# EAGLE design charge controller (EAGLE 9.4.0)
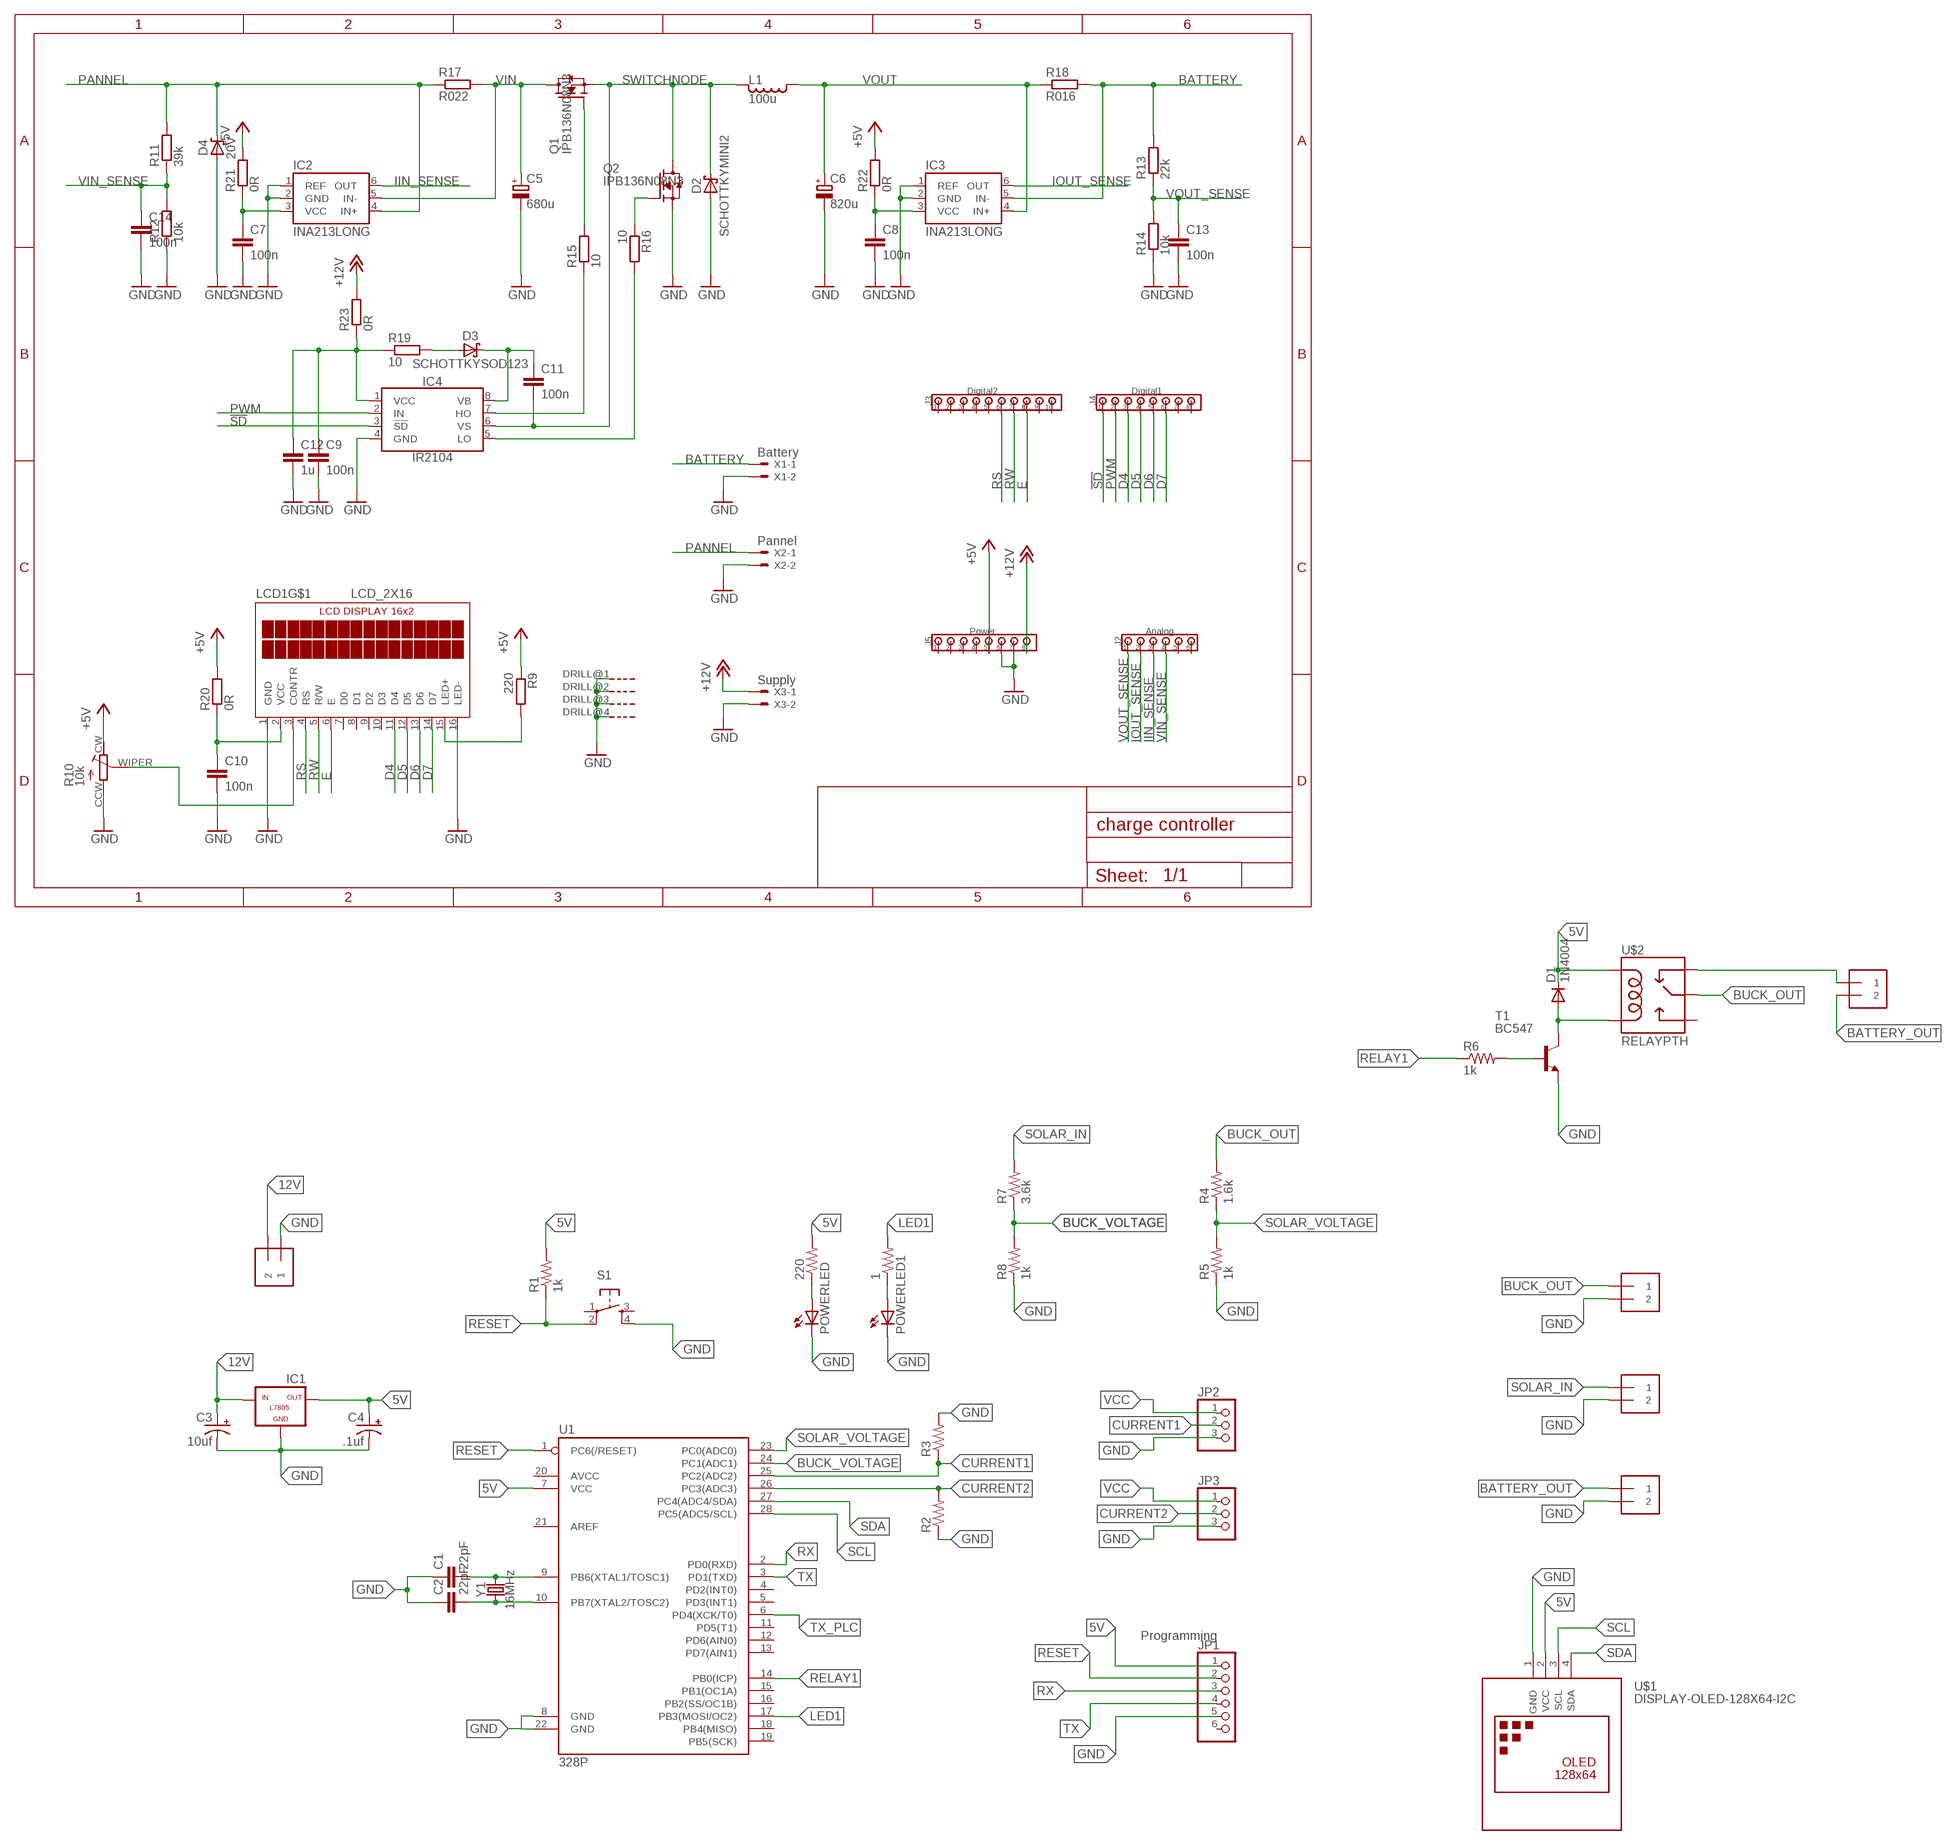
[diagram p0: schematic, sheet 1]

## Parts
1  R-US_0204/5  [0204/5]
220  R-US_0204/5  [0204/5]
BAT_OUT  1X2-3.5MM  [1X2-3.5MM]
BATTERY-OUT  1X2-3.5MM  [1X2-3.5MM]
BUCK-OUT  1X2-3.5MM  [1X2-3.5MM]
C1  22pF  22PF-PTH-2.54MM-200V-5%  [CAP-PTH-2.54]
C2  22pF  22PF-PTH-2.54MM-200V-5%  [CAP-PTH-2.54]
C3  10uf  CPOL-USE5-5  [E5-5]
C4  .1uf  CPOL-USE5-5  [E5-5]
C5  680u  C_POLARIZED10MM  [10MM]
C6  820u  C_POLARIZED10MM  [10MM]
C7  100n  CC0805  [C0805]
C8  100n  CC0805  [C0805]
C9  100n  CC0805  [C0805]
C10  100n  CC0805  [C0805]
C11  100n  CC0805  [C0805]
C12  1u  CC0805  [C0805]
C13  100n  CC0805  [C0805]
C14  100n  CC0805  [C0805]
D1  1N4004  [DO41-10]
D2  SCHOTTKYMINI2  [MINI2-F3-B]
D3  SCHOTTKYSOD123  [SOD123]
D4  20V  ZENERSMC  [SMC]
IC1  L7805  [78XXL]
IC2  INA213LONG  [SC70-6_LONG]
IC3  INA213LONG  [SC70-6_LONG]
IC4  IR2104  [SOIC8]
J1  1X2-3.5MM  [1X2-3.5MM]
J2  Analog  100MIL_6X  [100MIL_6X_ROUND]
J3  Digital2  100MIL_10X  [100MIL_10X_ROUND]
J4  Digital1  100MIL_8X  [100MIL_8X_ROUND]
J5  Power  100MIL_8X  [100MIL_8X_ROUND]
JP1  PINHD-1X6  [1X06]
JP2  PINHD-1X3  [1X03]
JP3  PINHD-1X3  [1X03]
L1  100u  INDUCTORMSS1583  [MSS1583]
LCD1  LCD_2X16  [LCD_2X16]
POWERLED  LED5MM  [LED5MM]
POWERLED1  LED5MM  [LED5MM]
Q1  IPB136N08N3  N-PWR-MOSFETTO263-3  [TO263-3]
Q2  IPB136N08N3  IPB136N08N3_GTO263  [TO263-3@1]
R1  1k  R-US_0204/5  [0204/5]
R2  R-US_0204/5  [0204/5]
R3  R-US_0204/5  [0204/5]
R4  1.6k  R-US_0204/5  [0204/5]
R5  1k  R-US_0204/5  [0204/5]
R6  1k  R-US_0204/5  [0204/5]
R7  3.6k  R-US_0204/5  [0204/5]
R8  1k  R-US_0204/5  [0204/5]
R9  220  RESISTORR0805  [R0805]
R10  10k  TRIMMER3314G  [RTRIM3314G]
R11  39k  RESISTORR0805  [R0805]
R12  10k  RESISTORR0805  [R0805]
R13  22k  RESISTORR0805  [R0805]
R14  10k  RESISTORR0805  [R0805]
R15  10  RESISTORR0805  [R0805]
R16  10  RESISTORR0805  [R0805]
R17  R022  RESISTOR0612  [0612]
R18  R016  RESISTOR0612  [0612]
R19  10  RESISTORR0805  [R0805]
R20  0R  RESISTORR0805  [R0805]
R21  0R  RESISTORR0805  [R0805]
R22  0R  RESISTORR0805  [R0805]
R23  0R  RESISTORR0805  [R0805]
S1  TAC_SWITCHPTH  [TACTILE-PTH]
SOLAR-IN  1X2-3.5MM  [1X2-3.5MM]
T1  BC547  [TO92]
U1  328P  ATMEGA328P_PDIP  [DIP28]
U$1  DISPLAY-OLED-128X64-I2C  [DISPLAY-OLED-128X64-I2C]
U$2  RELAYPTH  [SRD-05VDC-SL-C]
X1  Battery  22-23-2021200MIL  [200MIL_2X]
X2  Pannel  22-23-2021200MIL  [200MIL_2X]
X3  Supply  22-23-2021100MIL  [22-23-2021]
Y1  16MHz  CRYSTAL-16MHZPTH-HC49US  [HC49US]

## Nets
5V: 220.2 C4.+ D1.C IC1.OUT JP1.1 R1.2 U1.7(VCC) U$1.2(VCC) U$2.COIL1
12V: C3.+ IC1.IN J1.2
!SD!: IC4.3(!SD!) J4.1
+5V: J5.5 R9.1 R10.CW R20.2 R21.2 R22.2
+12V: J5.8 R23.2 X3.1
BATTERY: IC3.5(IN-) R13.2 R18.2 X1.1
BATTERY_OUT: BAT_OUT.2 BATTERY-OUT.1
BUCK_OUT: BUCK-OUT.1 R4.2 U$2.SWCOMMON
BUCK_VOLTAGE: R7.1 R8.2 U1.24(PC1(ADC1))
CURRENT1: JP2.2 R3.1 U1.25(PC2(ADC2))
CURRENT2: JP3.2 R2.2 U1.26(PC3(ADC3))
D4: J4.3 LCD1.11(D4)
D5: J4.4 LCD1.12(D5)
D6: J4.5 LCD1.13(D6)
D7: J4.6 LCD1.14(D7)
E: J3.8 LCD1.6(E)
GND: BATTERY-OUT.2 BUCK-OUT.2 C1.1 C2.1 C3.- C4.- C5.- C6.- C7.2 C8.2 C9.2 C10.2 C12.2 C13.2 C14.2 D2.A D4.A IC1.GND IC2.1(REF) IC2.2(GND) IC3.1(REF) IC3.2(GND) IC4.4(GND) J1.1 J5.6 J5.7 JP1.5 JP2.3 JP3.3 LCD1.1(GND) LCD1.16(LED-) LCD1.DRILL@1(G) LCD1.DRILL@2(G) LCD1.DRILL@3(G) LCD1.DRILL@4(G) POWERLED1.K(C) POWERLED.K(C) Q2.3(S) R2.1 R3.2 R5.1 R8.1 R10.CCW R12.1 R14.1 S1.4 SOLAR-IN.2 T1.1(E) U1.8(GND) U1.22(GND) U$1.1(GND) X1.2 X2.2 X3.2
IIN_SENSE: IC2.6(OUT) J2.3
IOUT_SENSE: IC3.6(OUT) J2.2
LED1: 1.2 U1.17(PB3(MOSI/OC2))
N$1: 220.1 POWERLED.A
N$2: C1.2 U1.9(PB6(XTAL1/TOSC1)) Y1.2
N$3: C2.2 U1.10(PB7(XTAL2/TOSC2)) Y1.1
N$4: LCD1.15(LED+) R9.2
N$5: 1.1 POWERLED1.A
N$6: R6.2 T1.2(B)
N$7: D1.A T1.3(C) U$2.COIL0
N$8: Q1.1(G) R15.2
N$9: BAT_OUT.1 U$2.SWCLOSED(SWCLOSE)
N$10: LCD1.3(CONTR) R10.WIPER
N$11: Q2.1(G) R16.1
N$12: D3.A R19.2
N$13: C11.1 D3.C IC4.8(VB)
N$14: IC4.7(HO) R15.1
N$15: IC4.5(LO) R16.2
N$16: C10.1 LCD1.2(VCC) R20.1
N$17: C7.1 IC2.3(VCC) R21.1
N$18: C8.1 IC3.3(VCC) R22.1
N$19: C9.1 C12.1 IC4.1(VCC) R19.1 R23.1
PANNEL: D4.C IC2.4(IN+) R11.2 R17.1 X2.1
PWM: IC4.2(IN) J4.2
RELAY1: R6.1 U1.14(PB0(ICP))
RESET: JP1.2 R1.1 S1.2 U1.1(PC6(/RESET))
RS: J3.6 LCD1.4(RS)
RW: J3.7 LCD1.5(R/W)
RX: JP1.3 U1.2(PD0(RXD))
SCL: U1.28(PC5(ADC5/SCL)) U$1.3(SCL)
SDA: U1.27(PC4(ADC4/SDA)) U$1.4(SDA)
SOLAR_IN: R7.2 SOLAR-IN.1
SOLAR_VOLTAGE: R4.1 R5.2 U1.23(PC0(ADC0))
SWITCHNODE: C11.2 D2.C IC4.6(VS) L1.2 Q1.3(S) Q2.TAB(D)
TX: JP1.4 U1.3(PD1(TXD))
TX_PLC: U1.6(PD4(XCK/T0))
VCC: JP2.1 JP3.1
VIN: C5.+ IC2.5(IN-) Q1.TAB(D) R17.2
VIN_SENSE: C14.1 J2.4 R11.1 R12.2
VOUT: C6.+ IC3.4(IN+) L1.1 R18.1
VOUT_SENSE: C13.1 J2.1 R13.1 R14.2
Unconnected: J2.5 J2.6 J3.1 J3.2 J3.3 J3.4 J3.5 J3.9 J3.10 J4.7 J4.8 J5.1 J5.2 J5.3 J5.4 JP1.6 LCD1.7(D0) LCD1.8(D1) LCD1.9(D2) LCD1.10(D3) S1.1 S1.3 U1.4(PD2(INT0)) U1.5(PD3(INT1)) U1.11(PD5(T1)) U1.12(PD6(AIN0)) U1.13(PD7(AIN1)) U1.15(PB1(OC1A)) U1.16(PB2(SS/OC1B)) U1.18(PB4(MISO)) U1.19(PB5(SCK)) U1.20(AVCC) U1.21(AREF) U$2.SWOPEN

## Notes on the sheet
- Programming

## Library data of the parts
1 220 R1-R8 = adafruit:R-US_: RESISTOR, American symbol
BAT_OUT BATTERY-OUT BUCK-OUT J1 SOLAR-IN = adafruit:1X2: 3.5mm Terminal block http://www.ladyada.net/library/pcb/eaglelibrary.html
C1 C2 = SparkFun-Capacitors:22PF: 22pF ceramic capacitors A capacitor is a passive two-terminal electrical component used to store electrical energy temporarily in an electric field.; PROD_ID: CAP-09128
C3 C4 = adafruit:CPOL-US: POLARIZED CAPACITOR, American symbol
C5 C6 = 00Capacitor:C_POLARIZED
C7-C14 = 00Capacitor:C: Capacitor
D1 = adafruit:1N4004: DIODE General purpose 1N400x type rectifier (With bigger pads) http://www.ladyada.net/library/pcb/eaglelibrary.html
D2 D3 = 00Diode:SCHOTTKY
D4 = 00Diode:ZENER
IC1 = tango:L7805: VOLTAGE REGULATOR
IC2 IC3 = 00Sensor:INA21*: Current-Shunt Monitors Voltage Output, Low- or High-Side Measurement, Bidirectional, Zero-Drift Series; GAIN: 50
IC4 = 00Logic:IR2104: Half-Bridge Driver Up to +600V Gate drive supply 10-20V Deadtime 520ns
J2 = 00Connector:100MIL_6X: 100 mil 6-pin connector
J3 = 00Connector:100MIL_10X: 100mil 10-pin connector
J4 J5 = 00Connector:100MIL_8X: 100 mil 8-pin connector
JP1 = adafruit:PINHD-1X6: PIN HEADER
JP2 JP3 = adafruit:PINHD-1X3: PIN HEADER
L1 = 00Inductor:INDUCTOR
LCD1 = 00Display:LCD_2X16
POWERLED POWERLED1 = adafruit:LED: LED OSRAM: - CHIPLED LG R971, LG N971, LY N971, LG Q971, LY Q971, LO R971, LY R971 LH N974, LH R974 LS Q976, LO Q976, LY Q976 LO Q996 - Hyper CHIPLED LW Q18S LB Q993, LB Q99A, LB R99A - SideLED LS A670, LO A670, LY A670, LG A670, LP A670 LB A673, LV A673, LT A673, LW A673 LH A674 LY A675 LS A676, LA A676, LO A676, LY A676, LW A676 LS A679, LY A679, LG A679 - Hyper Micro SIDELED® LS Y876, LA Y876, LO Y876, LY Y876 LT Y87S - SmartLED LW L88C, LW L88S LB L89C, LB L89S, LG L890 LS L89K, LO L89K, LY L89K LS L896, LA L896, LO L896, LY L896 - TOPLED LS T670, LO T670, LY T670, LG T670, LP T670 LSG T670, LSP T670, LSY T670, LOP T670, LYG T670 LG T671, LOG T671, LSG T671 LB T673, LV T673, LT T673, LW T673 LH T674 LS T676, LA T676, LO T676, LY T676, LB T676, LH T676, LSB T676, LW T676 LB T67C, LV T67C, LT T67C, LS T67K, LO T67K, LY T67K, LW E67C LS E67B, LA E67B, LO E67B, LY E67B, LB E67C, LV E67C, LT E67C LW T67C LS T679, LY T679, LG T679 LS T770, LO T770, LY T770, LG T770, LP T770 LB T773, LV T773, LT T773, LW T773 LH T774 LS E675, LA E675, LY E675, LS T675 LS T776, LA T776, LO T776, LY T776, LB T776 LHGB T686 LT T68C, LB T68C - Hyper Mini TOPLED® LB M676 - Mini TOPLED Santana® LG M470 LS M47K, LO M47K, LY M47K Source: http://www.osram.convergy.de/
Q1 = 00Mosfet:N-PWR-MOSFET
Q2 = 00Mosfet:IPB136N08N3_G
R9 R11-R23 = 00Resistor:RESISTOR: RESISTOR, European symbol
R10 = 00Resistor:TRIMMER
S1 = SparkFun-Retired:TAC_SWITCH: Momentary Switch Button commonly used for reset or general input. Spark Fun Electronics SKU : COM-00097 SMT- SWCH-08247
T1 = transistor:BC547: NPN TRANSISTOR
U1 = SparkFun-IC-Microcontroller:ATMEGA328P_PDIP: Atmel 328P Through hole ATMEGA328P uC used in the Arduino 32kb flash, 1k EEPROM, 2k SRAM Datasheet <http://www.sparkfun.com/datasheets/Components/SMD/ATMega328.pdf> SparkFun Products Storefront component: AVR 28 Pin 20MHz 32K 6A/D - ATMega328P <https://www.sparkfun.com/products/9061> (COM-09061) SparkFun Simon Says - Through-Hole Soldering Kit <https://www.sparkfun.com/products/10547> (KIT-10547) SparkFun Learn to Solder - Simon Says <https://www.sparkfun.com/products/13708> (KIT-13708) SparkFun BigTime Watch Kit <https://www.sparkfun.com/products/11734> (KIT-11734) SparkFun ClockIt <https://www.sparkfun.com/products/10930> (KIT-10930) SparkFun Serial Enabled LCD Kit <https://www.sparkfun.com/products/10097> (LCD-10097) SparkFun Simon Tilts - Through Hole Soldering Kit <https://www.sparkfun.com/products/12634> (KIT-12634) SparkFun Frequency Counter Kit <https://www.sparkfun.com/products/10140> (KIT-10140) FabFM Radio Kit <https://www.sparkfun.com/products/11043> (KIT-11043) SparkFun Binary Blaster Kit <https://www.sparkfun.com/products/12037> (KIT-12037) SparkFun Metro-Gnome <https://www.sparkfun.com/products/9236> (KIT-09236) ATmega328 with Arduino Optiboot (Uno) <https://www.sparkfun.com/products/10524> (DEV-10524); PROD_ID: IC-09136
U$1 = diy-modules:DISPLAY-OLED-128X64-I2C: 128x64 Dot Matrix OLED Module based on SSD1306 chip Variant with I2C interface More details available here: http://www.instructables.com/id/Monochrome-096-i2c-OLED-display-with-arduino-SSD13/ SSD1306 datasheet: https://cdn-shop.adafruit.com/datasheets/SSD1306.pdf Click here to find device on ebay.com <http://www.ebay.com/sch/oled+display+128x64+iic> Note: There are two variants: I2C and SPI. Search for the proper version.
U$2 = SRD-05VDC-SL-C:RELAY: SPDT relay (COM-00101)
X1 X2 = 00Connector:22-23-2021: .100" (2.54mm) Center Header - 2 Pin
X3 = 00Connector:22-23-2021: .100" (2.54mm) Center Header - 2 Pin; MF: MOLEX; MPN: 22-23-2021; OC_FARNELL: 1462926; OC_NEWARK: 25C3832
Y1 = SparkFun-Clocks:CRYSTAL-16MHZ: 16MHz Crystal Digikey Example <http://www.digikey.com/product-search/en?keywords=535-9122-1-ND> Frequency: 16MHz Frequency Stability: ±50ppm Frequency Tolerance: ±20ppm Load Capacitance: 18pF SparkFun Products: Pro Micro -5V/16MHz <https://www.sparkfun.com/products/12640> SparkFun Serial Enabled LCD Kit <https://www.sparkfun.com/products/10097>; PROD_ID: XTAL-08181; SF_ID: COM-00536

## Board
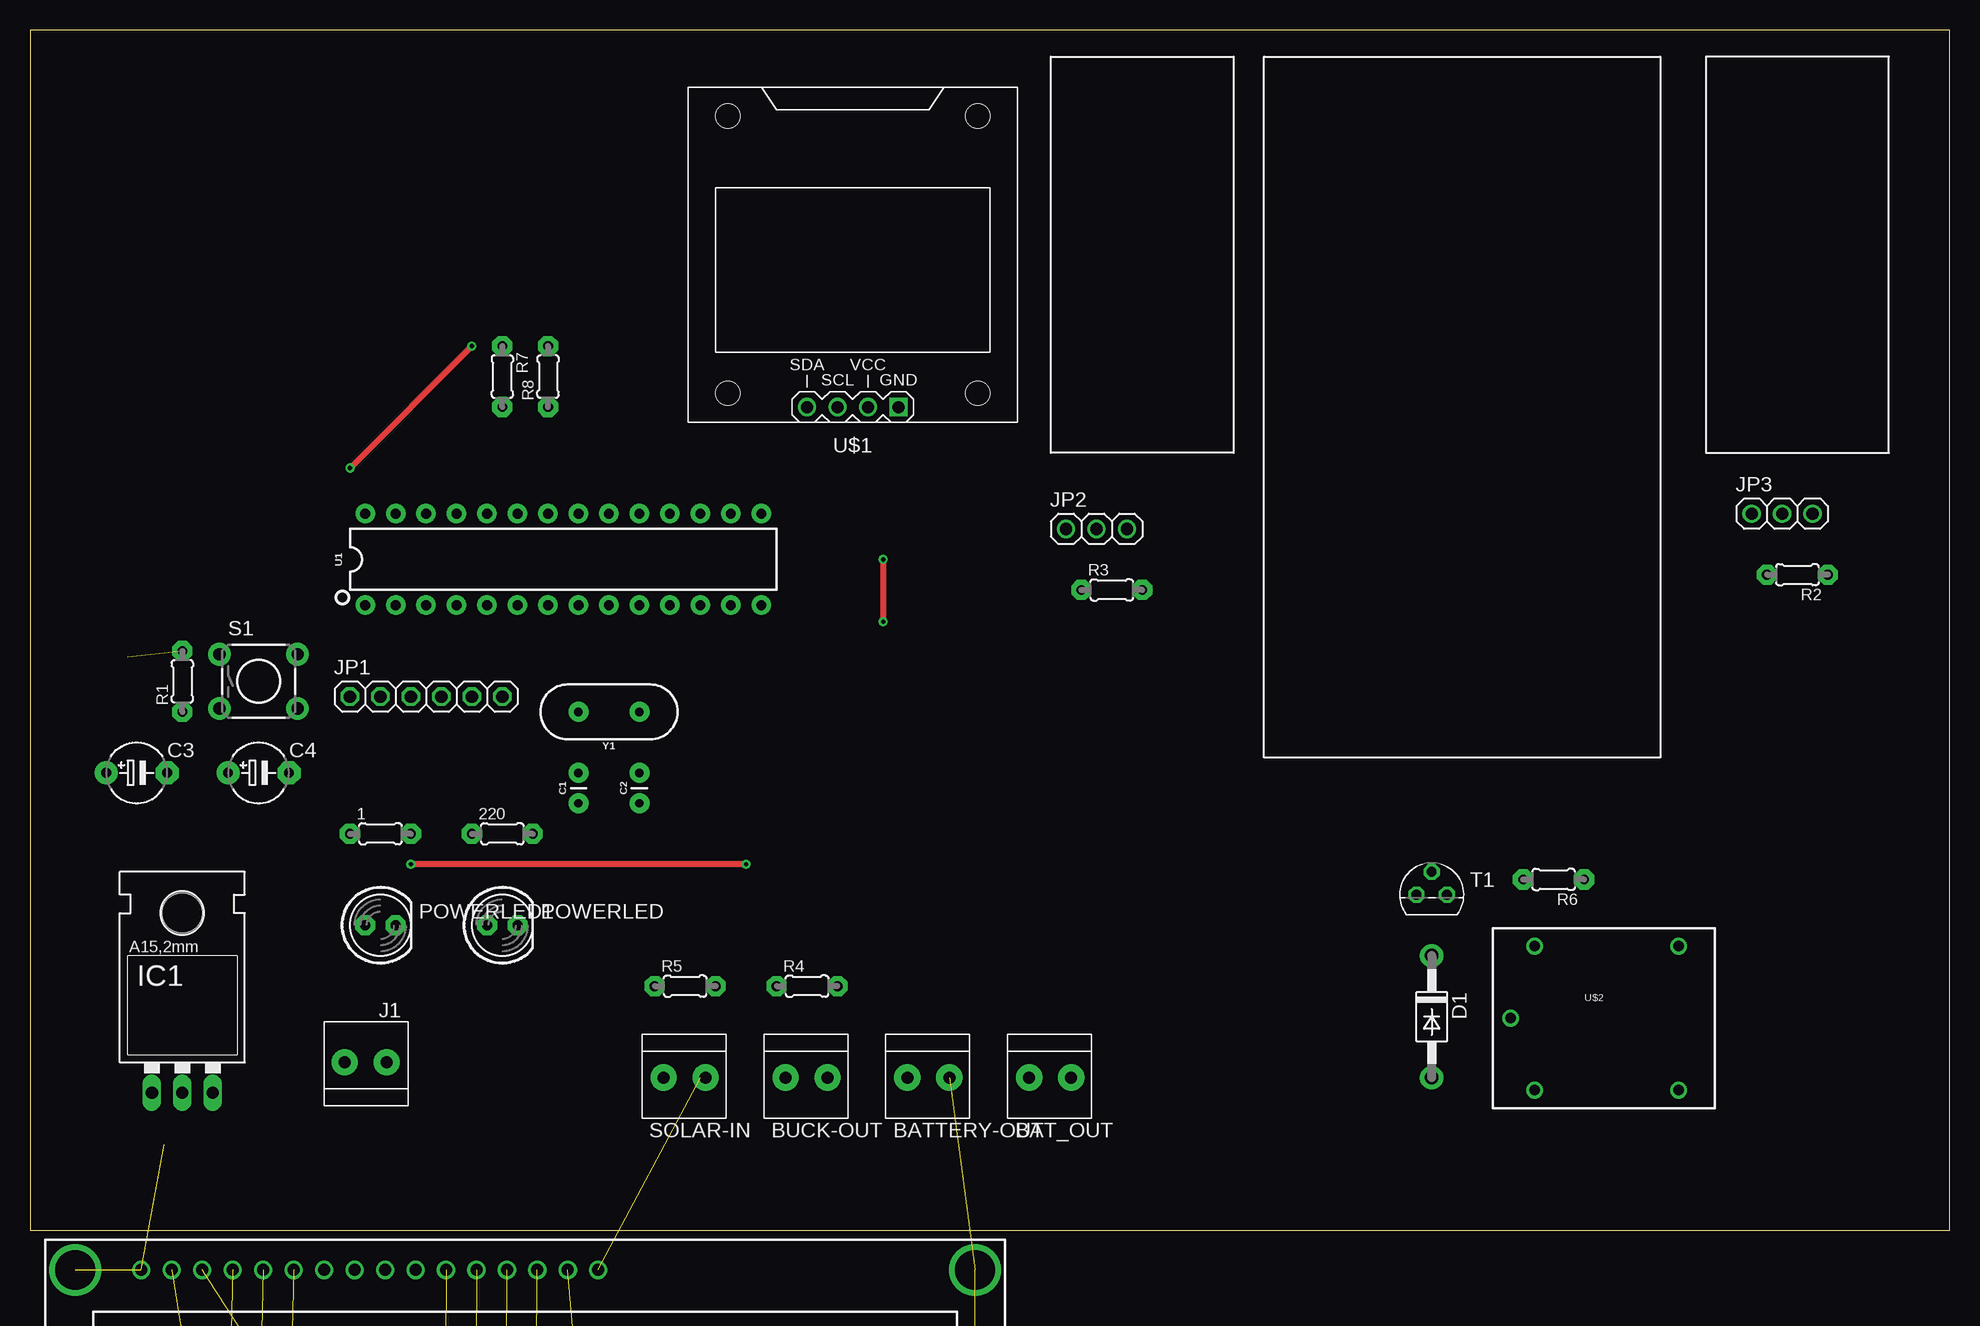
[diagram p1: board, top side]
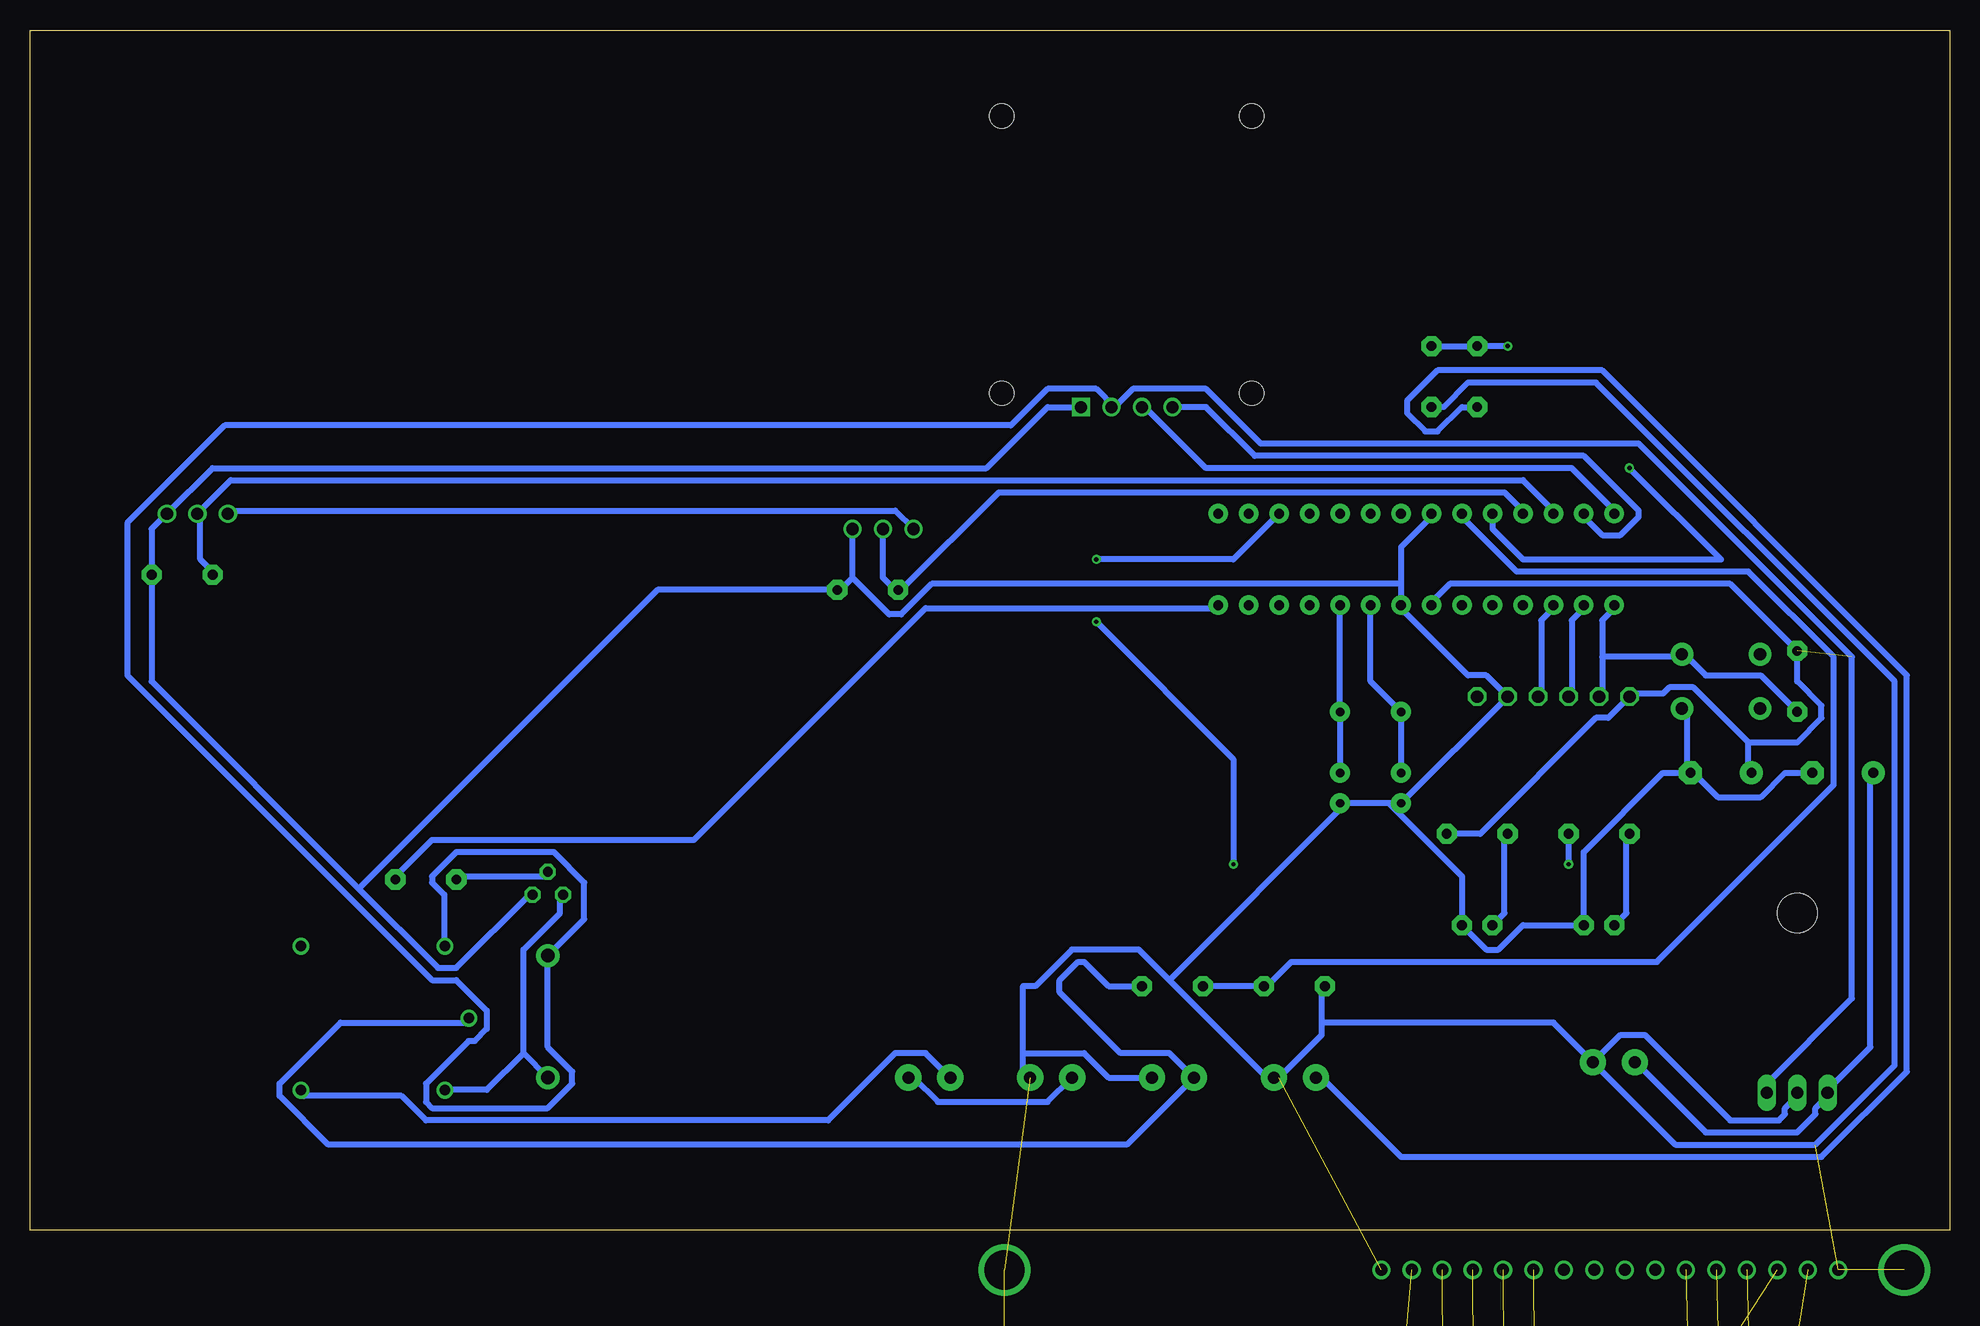
[diagram p2: board, bottom side, seen from below]

Size 160 x 100 mm. Coordinates in mm from the lower left corner, seen from the top.
Outline: 0,0 160,0 160,100 0,100 0,0
Copper layers (1*16): Top 0.035mm / dielectric 1.5mm / Bottom 0.035mm
Design rules "default *": minimum track width 20mil, minimum drill 0.35mm, track to track 20mil, track to pad 20mil, pad to pad 6mil, via to via 6mil, smd to smd 6mil, copper to edge 40mil, drill to drill 6mil, minimum pad ring 10mil, minimum via ring 8mil, stop-mask expansion 4mil, vias tented up to drill 0mil, thermal gap 10mil

### Footprints (pad centres in the part's own frame; a part is rotated, then mirrored left to right if it is on the bottom)
0204/5 = drill 0.813 pad 1.676 octagon: 1 -2.54,0; 2 2.54,0
1X2-3.5MM = drill 1 pad 2.184: 1 1.8,0; 2 -1.7,0
CAP-PTH-2.54 = drill 0.7 pad 1.651: 1 -1.27,0; 2 1.27,0
E5-5 = drill 0.813 pad 1.905: + -2.54,0 | drill 0.813 pad 1.905 octagon: - 2.54,0
10MM = drill 1.016 pad 2.54: + -2.5,0 | drill 1.016 pad 2.54 octagon: - 2.5,0
C0805 = smd 1.3 x 1.5: 1 -0.95,0; 2 0.95,0
DO41-10 = drill 1.118 pad 1.93: A 5.08,0; C -5.08,0
MINI2-F3-B = smd 1.6 x 1.4: A 1.8,0; C -1.8,0
SOD123 = smd 1.4 x 1.4: A 1.9,0; C -1.9,0
SMC = smd 2.8 x 3.8: A 3.7,0; C -3.7,0
78XXL = drill 1.016 long: GND 0,-3.81; IN -2.54,-3.81; OUT 2.54,-3.81 | hole 3.302: 0,11.176
SC70-6_LONG = smd 0.35 x 1.5: 1 -0.65,-1.2; 2 0,-1.2; 3 0.65,-1.2; 4 0.65,1.2; 5 0,1.2; 6 -0.65,1.2
SOIC8 = smd 1.981 x 0.559: 1 -2.362,1.905; 2 -2.362,0.635; 3 -2.362,-0.635; 4 -2.362,-1.905; 5 2.362,-1.905; 6 2.362,-0.635; 7 2.362,0.635; 8 2.362,1.905
100MIL_6X_ROUND = drill 1 pad 1.6: 1 -6.35,0; 2 -3.81,0; 3 -1.27,0; 4 1.27,0; 5 3.81,0; 6 6.35,0
100MIL_10X_ROUND = drill 1 pad 1.6: 1 -8.89,0; 2 -6.35,0; 3 -3.81,0; 4 -1.27,0; 5 1.27,0; 6 3.81,0; 7 6.35,0; 8 8.89,0; 9 11.43,0; 10 13.97,0
100MIL_8X_ROUND = drill 1 pad 1.6: 1 -8.89,0; 2 -6.35,0; 3 -3.81,0; 4 -1.27,0; 5 1.27,0; 6 3.81,0; 7 6.35,0; 8 8.89,0
1X06 = drill 1.016 octagon: 1 -6.35,0; 2 -3.81,0; 3 -1.27,0; 4 1.27,0; 5 3.81,0; 6 6.35,0
1X03 = drill 1.016: 1 -2.54,0; 2 0,0; 3 2.54,0
MSS1583 = smd 6 x 7: 1 -6.85,0; 2 6.85,0
LCD_2X16 = drill 1: 1 8,33.5; 2 10.54,33.5; 3 13.08,33.5; 4 15.62,33.5; 5 18.16,33.5; 6 20.7,33.5; 7 23.24,33.5; 8 25.78,33.5; 9 28.32,33.5; 10 30.86,33.5; 11 33.4,33.5; 12 35.94,33.5; 13 38.48,33.5; 14 41.02,33.5; 15 43.56,33.5; 16 46.1,33.5 | drill 3.3: DRILL@1 2.5,33.5; DRILL@2 77.5,33.5; DRILL@3 77.5,2.5; DRILL@4 2.5,2.5
LED5MM = drill 0.813 pad 1.676 octagon: A -1.27,0; K 1.27,0
TO263-3 = smd 1.45 x 4.7: 1 -2.54,-5.65; 3 2.54,-5.65 | smd 10.9 x 10.5: TAB 0,3.5
TO263-3@1 = smd 1 x 3.4: 1 -2.54,-6.6; 3 2.54,-6.6 | smd 6.8 x 9.6: TAB 0,3.5
R0805 = smd 1.3 x 1.5: 1 -0.95,0; 2 0.95,0
RTRIM3314G = smd 1.3 x 1.5: CCW 1.15,-2.85; CW -1.15,-2.85 | smd 2 x 1.5: WIPER 0,2.85
0612 = smd 1 x 3.7: 1 -0.9,0; 2 0.9,0
TACTILE-PTH = drill 1.016 pad 1.88: 1 -3.251,2.261; 2 3.251,2.261; 3 -3.251,-2.261; 4 3.251,-2.261
TO92 = drill 0.813 octagon: 1 1.27,0; 2 0,1.905; 3 -1.27,0
DIP28 = drill 0.813 pad 1.626: 1 -16.51,-3.81; 2 -13.97,-3.81; 3 -11.43,-3.81; 4 -8.89,-3.81; 5 -6.35,-3.81; 6 -3.81,-3.81; 7 -1.27,-3.81; 8 1.27,-3.81; 9 3.81,-3.81; 10 6.35,-3.81; 11 8.89,-3.81; 12 11.43,-3.81; 13 13.97,-3.81; 14 16.51,-3.81; 15 16.51,3.81; 16 13.97,3.81; 17 11.43,3.81; 18 8.89,3.81; 19 6.35,3.81; 20 3.81,3.81; 21 1.27,3.81; 22 -1.27,3.81; 23 -3.81,3.81; 24 -6.35,3.81; 25 -8.89,3.81; 26 -11.43,3.81; 27 -13.97,3.81; 28 -16.51,3.81
DISPLAY-OLED-128X64-I2C = drill 1 square: 1 -3.81,12.7 | drill 1: 2 -1.27,12.7; 3 1.27,12.7; 4 3.81,12.7 | hole 2: -10.414,11.557; 10.414,11.557; 10.414,-11.557; -10.414,-11.557
SRD-05VDC-SL-C = drill 0.9: COIL0 -5.39,-6.12; COIL1 -5.39,5.88; SWCLOSED 6.61,-6.12; SWCOMMON -7.39,-0.12; SWOPEN 6.61,5.88
200MIL_2X = drill 1.5 long: 1 -2.54,0; 2 2.54,0
22-23-2021 = drill 1 long: 1 -1.27,0; 2 1.27,0
HC49US = drill 0.7 pad 1.651: 1 -2.54,0; 2 2.54,0

### Placement (x,y rotation side)
1  29.21,33.02 0 top
220  39.37,33.02 0 top
BAT_OUT  85.09,12.7 180 top
BATTERY-OUT  74.93,12.7 180 top
BUCK-OUT  64.77,12.7 180 top
C1  45.72,36.83 90 top
C2  50.8,36.83 90 top
C3  8.89,38.1 0 top
C4  19.05,38.1 0 top
C5  24.13,-62.23 0 top  (outside the outline)
C6  36.83,-62.23 0 top  (outside the outline)
C7  10.16,-82.55 0 top  (outside the outline)
C8  15.24,-82.55 0 top  (outside the outline)
C9  20.32,-82.55 0 top  (outside the outline)
C10  25.4,-82.55 0 top  (outside the outline)
C11  30.48,-82.55 0 top  (outside the outline)
C12  35.56,-82.55 0 top  (outside the outline)
C13  40.64,-82.55 0 top  (outside the outline)
C14  45.72,-82.55 0 top  (outside the outline)
D1  116.84,17.78 270 top
D2  39.37,-77.47 0 top  (outside the outline)
D3  20.32,-77.47 0 top  (outside the outline)
D4  12.7,-62.23 0 top  (outside the outline)
IC1  12.7,15.24 0 top
IC2  55.88,-77.47 0 top  (outside the outline)
IC3  66.04,-77.47 0 top  (outside the outline)
IC4  52.07,-44.45 0 top  (outside the outline)
J1  27.94,13.97 0 top
J2  8.89,-77.47 0 top  (outside the outline)
J3  11.43,-71.12 0 top  (outside the outline)
J4  38.1,-71.12 0 top  (outside the outline)
J5  59.69,-71.12 0 top  (outside the outline)
JP1  33.02,44.45 0 top
JP2  88.9,58.42 0 top
JP3  146.05,59.69 0 top
L1  35.56,-45.72 0 top  (outside the outline)
LCD1  1.27,-36.83 0 top  (outside the outline)
POWERLED  39.37,25.4 0 top
POWERLED1  29.21,25.4 0 top
Q1  6.35,-46.99 0 top  (outside the outline)
Q2  19.05,-46.99 0 top  (outside the outline)
R1  12.7,45.72 90 top
R2  147.32,54.61 180 top
R3  90.17,53.34 0 top
R4  64.77,20.32 0 top
R5  54.61,20.32 0 top
R6  127,29.21 180 top
R7  39.37,71.12 270 top
R8  43.18,71.12 90 top
R9  50.8,-82.55 0 top  (outside the outline)
R10  49.53,-60.96 0 top  (outside the outline)
R11  55.88,-82.55 0 top  (outside the outline)
R12  60.96,-82.55 0 top  (outside the outline)
R13  66.04,-82.55 0 top  (outside the outline)
R14  71.12,-82.55 0 top  (outside the outline)
R15  2.54,-86.36 0 top  (outside the outline)
R16  7.62,-86.36 0 top  (outside the outline)
R17  2.54,-82.55 0 top  (outside the outline)
R18  6.35,-82.55 0 top  (outside the outline)
R19  12.7,-86.36 0 top  (outside the outline)
R20  17.78,-86.36 0 top  (outside the outline)
R21  22.86,-86.36 0 top  (outside the outline)
R22  27.94,-86.36 0 top  (outside the outline)
R23  33.02,-86.36 0 top  (outside the outline)
S1  19.05,45.72 0 top
SOLAR-IN  54.61,12.7 180 top
T1  116.84,27.94 0 top
U1  44.45,55.88 0 top
U$1  68.58,81.28 180 top
U$2  130.81,17.78 0 top
X1  62.23,-43.18 0 top  (outside the outline)
X2  71.12,-43.18 0 top  (outside the outline)
X3  3.81,-62.23 0 top  (outside the outline)
Y1  48.26,43.18 180 top

### Tracks (layer width: path | path; a pad name or v marks a point on that pad's centre or on a via)
5V  (1 unrouted)
  Bottom 0.508: U$2.COIL1 125.48,23.88 125.48,27.94 126.49,28.96 126.49,29.46 124.46,31.5 116.33,31.5 113.79,28.96 113.79,25.91 D1.C 116.84,15.24 114.81,13.21 114.81,12.19 116.84,10.16 126.49,10.16 127,10.67 127,12.19 123.44,15.75 122.94,15.75 121.92,16.76 121.92,18.29 124.46,20.83 126.49,20.83 151.89,46.23 151.89,58.93 143.76,67.06 78.23,67.06 75.18,70.1 71.12,70.1 69.6,68.58 | 69.6,68.58 68.07,70.1 61.98,70.1 57.4,65.53 25.91,65.53 8.13,47.75 8.13,19.3 15.24,12.19 IC1.OUT | 69.6,68.58 U$1.2 | U1.7 43.18,52.32 41.66,53.85 18.29,53.85 R1.2 12.7,45.72 10.67,43.69 10.67,42.67 12.7,40.64 16.76,40.64 | 16.76,40.64 21.34,45.21 23.37,45.21 23.88,44.7 26.42,44.7 JP1.1 28.45,42.67 29.46,42.67 39.12,33.02 220.2 | 16.76,40.64 16.76,38.1 C4.+
12V
  Bottom 0.508: J1.2 25.91,13.72 20.32,8.13 12.7,8.13 11.18,9.65 11.18,10.16 10.16,11.18 IC1.IN 10.16,11.68 6.6,15.24 6.6,38.1 C3.+
!SD!  (1 unrouted)
+5V  (5 unrouted)
+12V  (2 unrouted)
BATTERY  (3 unrouted)
BATTERY_OUT
  Bottom 0.508: BATTERY-OUT.1 73.15,12.7 75.18,10.67 84.33,10.67 86.36,12.7 BAT_OUT.2
BUCK_OUT
  Bottom 0.508: 62.99,12.7 68.58,7.11 135.13,7.11 139.19,11.18 139.19,12.19 134.11,17.27 123.44,17.27 U$2.SWCOMMON | R4.2 70.1,20.32 72.14,22.35 72.64,22.35 74.17,20.83 74.17,19.81 69.09,14.73 65.02,14.73 62.99,12.7 | 62.99,12.7 BUCK-OUT.1
BUCK_VOLTAGE  (via drill 0.35)
  Top 0.508: v26.67,63.5 v36.83,73.66
  Bottom 0.508: R8.2 R7.1 v36.83,73.66 | U1.24 38.1,58.42 35.56,55.88 19.05,55.88 v26.67,63.5
CURRENT1
  Bottom 0.508: JP2.2 88.9,54.36 87.88,53.34 R3.1 87.38,53.34 79.25,61.47 37.08,61.47 35.56,59.94 U1.25
CURRENT2
  Bottom 0.508: R2.2 144.78,54.86 145.8,55.88 145.8,59.44 JP3.2 143.26,62.48 35.56,62.48 33.02,59.94 U1.26
D4  (1 unrouted)
D5  (1 unrouted)
D6  (1 unrouted)
D7  (1 unrouted)
E  (1 unrouted)
GND  (31 unrouted)
  Bottom 0.508: 132.59,28.45 149.86,45.72 R2.1 149.86,58.42 JP3.3 144.78,63.5 80.26,63.5 75.18,68.58 U$1.1 | 132.59,28.45 125.98,21.84 124.46,21.84 118.36,27.94 T1.1 | 77.22,14.73 77.22,13.21 76.71,12.7 BATTERY-OUT.2 | 77.22,14.73 77.22,20.32 76.2,20.32 73.15,23.37 67.56,23.37 65.02,20.83 | BUCK-OUT.2 70.1,12.7 72.14,14.73 77.22,14.73 | 52.32,17.27 52.32,16.26 55.88,12.7 SOLAR-IN.2 56.9,12.7 65.02,20.83 | 52.32,17.27 52.32,20.32 R5.1 | IC1.GND 12.7,11.18 13.72,10.16 13.72,9.65 14.22,9.14 18.29,9.14 25.4,16.26 27.43,16.26 29.46,14.22 J1.1 | 52.32,17.27 33.02,17.27 29.97,14.22 J1.1 | 91.44,54.36 JP2.3 | 91.44,54.36 92.46,53.34 R3.2 107.7,53.34 132.59,28.45 | 45.72,53.85 45.72,56.9 43.18,59.44 U1.22 | 45.72,53.85 U1.8 45.72,51.82 40.13,46.23 38.61,46.23 JP1.5 C1.1 46.74,35.56 | 91.44,54.36 88.39,51.31 87.38,51.31 84.84,53.85 45.72,53.85 | 21.84,38.1 21.84,43.18 S1.4 | C3.- 13.72,38.1 15.75,36.07 19.3,36.07 21.34,38.1 C4.- 21.84,38.1 | 46.74,35.56 50.29,35.56 | 46.74,35.56 40.64,29.46 POWERLED.K 38.61,23.37 37.59,23.37 35.56,25.4 POWERLED1.K 30.48,31.5 23.88,38.1 21.84,38.1 | 50.29,35.56 65.02,20.83 | 50.29,35.56 C2.1 | R8.1 42.16,68.58 40.13,70.61 29.46,70.61 4.57,45.72 4.57,13.72 11.18,7.11 22.86,7.11 29.46,13.72 J1.1
IIN_SENSE  (1 unrouted)
IOUT_SENSE  (1 unrouted)
LED1  (via drill 0.35)
  Top 0.508: v71.12,55.88 v71.12,50.68 | v59.69,30.48 v31.75,30.48
  Bottom 0.508: U1.17 59.69,55.88 v71.12,55.88 | v31.75,30.48 1.2 | v71.12,50.68 59.69,39.25 v59.69,30.48
N$1
  Bottom 0.508: POWERLED.A 37.08,26.42 37.08,33.02 220.1
N$2
  Bottom 0.508: U1.9 48.26,45.72 Y1.2 C1.2
N$3
  Bottom 0.508: U1.10 Y1.1 C2.2
N$4  (1 unrouted)
N$5
  Bottom 0.508: POWERLED1.A 26.92,26.42 26.92,33.02 1.1
N$6
  Bottom 0.508: T1.2 116.84,29.46 124.46,29.46 R6.2
N$7
  Bottom 0.508: 118.87,14.73 118.87,23.37 115.82,26.42 115.82,27.94 T1.3 | D1.A 118.87,14.73 | 118.87,14.73 121.92,11.68 124.97,11.68 U$2.COIL0
N$8  (1 unrouted)
N$9
  Bottom 0.508: U$2.SWCLOSED 137.16,11.18 129.03,11.18 127,9.14 93.47,9.14 87.88,14.73 85.34,14.73 83.31,12.7 BAT_OUT.1
N$10  (1 unrouted)
N$11  (1 unrouted)
N$12  (1 unrouted)
N$13  (2 unrouted)
N$14  (1 unrouted)
N$15  (1 unrouted)
N$16  (2 unrouted)
N$17  (2 unrouted)
N$18  (2 unrouted)
N$19  (4 unrouted)
PANNEL  (4 unrouted)
PWM  (1 unrouted)
RELAY1
  Bottom 0.508: U1.14 60.96,51.82 85.34,51.82 104.65,32.51 126.49,32.51 129.54,29.46 R6.1
RESET
  Bottom 0.508: 28.96,47.75 28.96,50.8 27.94,51.82 U1.1 | 28.96,47.75 28.96,44.7 JP1.2 | R1.1 15.75,46.23 20.32,46.23 21.84,47.75 S1.2 22.35,47.75 28.96,47.75
RS  (1 unrouted)
RW  (1 unrouted)
RX
  Bottom 0.508: JP1.3 31.5,44.7 31.5,50.8 30.48,51.82 U1.2
SCL
  Bottom 0.508: U$1.3 67.06,68.58 61.98,63.5 31.5,63.5 27.94,59.94 U1.28
SDA
  Bottom 0.508: U$1.4 61.98,68.58 57.91,64.52 30.48,64.52 25.91,59.94 25.91,59.44 27.43,57.91 28.96,57.91 30.48,59.44 U1.27
SOLAR_IN
  Bottom 0.508: R7.2 40.64,68.58 42.67,66.55 43.69,66.55 45.21,68.07 45.21,69.09 42.67,71.63 28.96,71.63 3.56,46.23 3.56,13.21 10.67,6.1 45.72,6.1 52.32,12.7 SOLAR-IN.1
SOLAR_VOLTAGE
  Bottom 0.508: U1.23 40.64,59.44 36.07,54.86 16.76,54.86 9.65,47.75 9.65,37.08 24.38,22.35 54.86,22.35 56.9,20.32 R5.2 R4.1
SWITCHNODE  (5 unrouted)
TX
  Bottom 0.508: JP1.4 34.04,44.7 34.04,50.8 33.02,51.82 U1.3
VCC
  Bottom 0.508: JP2.1 87.88,59.94 143.26,59.94 JP3.1
VIN  (3 unrouted)
VIN_SENSE  (3 unrouted)
VOUT  (3 unrouted)
VOUT_SENSE  (3 unrouted)